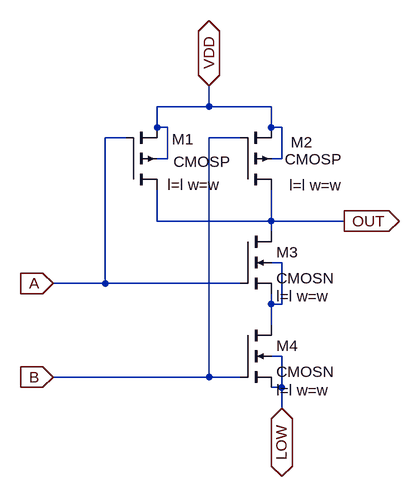
[diagram p0: schematic NAND.asc]
NAND.asc, the LTspice schematic file:
Version 4
SHEET 1 1024 680
WIRE 224 16 224 -16
WIRE 224 16 144 16
WIRE 320 16 224 16
WIRE 144 48 144 16
WIRE 160 48 144 48
WIRE 320 48 320 16
WIRE 336 48 320 48
WIRE 96 64 64 64
WIRE 272 64 224 64
WIRE 160 96 160 48
WIRE 160 96 144 96
WIRE 336 96 336 48
WIRE 336 96 320 96
WIRE 144 192 144 144
WIRE 320 192 320 144
WIRE 320 192 144 192
WIRE 432 192 320 192
WIRE 320 208 320 192
WIRE 336 256 320 256
WIRE 64 288 64 64
WIRE 64 288 -16 288
WIRE 272 288 64 288
WIRE 320 320 320 304
WIRE 336 320 336 256
WIRE 336 320 320 320
WIRE 320 352 320 320
WIRE 336 400 320 400
WIRE 224 432 224 64
WIRE 224 432 -16 432
WIRE 272 432 224 432
WIRE 336 448 336 400
WIRE 336 448 320 448
WIRE 336 480 336 448
FLAG 224 -16 VDD
IOPIN 224 -16 BiDir
FLAG 336 480 LOW
IOPIN 336 480 BiDir
FLAG 432 192 OUT
IOPIN 432 192 Out
FLAG -16 288 A
IOPIN -16 288 In
FLAG -16 432 B
IOPIN -16 432 In
SYMBOL nmos4 272 208 R0
WINDOW 123 56 100 Left 2
SYMATTR Value2 l=l w=w
SYMATTR InstName M3
SYMATTR Value CMOSN
SYMBOL nmos4 272 352 R0
WINDOW 123 56 100 Left 2
SYMATTR Value2 l=l w=w
SYMATTR InstName M4
SYMATTR Value CMOSN
SYMBOL pmos4 96 144 M180
WINDOW 123 64 8 Left 2
WINDOW 0 71 78 Left 2
WINDOW 3 73 43 Left 2
SYMATTR Value2 l=l w=w
SYMATTR InstName M1
SYMATTR Value CMOSP
SYMBOL pmos4 272 144 M180
WINDOW 123 76 7 Left 2
WINDOW 0 78 73 Left 2
WINDOW 3 69 47 Left 2
SYMATTR Value2 l=l w=w
SYMATTR InstName M2
SYMATTR Value CMOSP

The netlist it stands for:
* NAND.asc
M3 OUT A N001 N001 CMOSN l=l w=w
M4 N001 B LOW LOW CMOSN l=l w=w
M1 OUT A VDD VDD CMOSP l=l w=w
M2 OUT B VDD VDD CMOSP l=l w=w
.model NMOS NMOS
.model PMOS PMOS
.lib standard.mos
.backanno
.end